# EAGLE design quantizer_control (EAGLE 6.6.0)
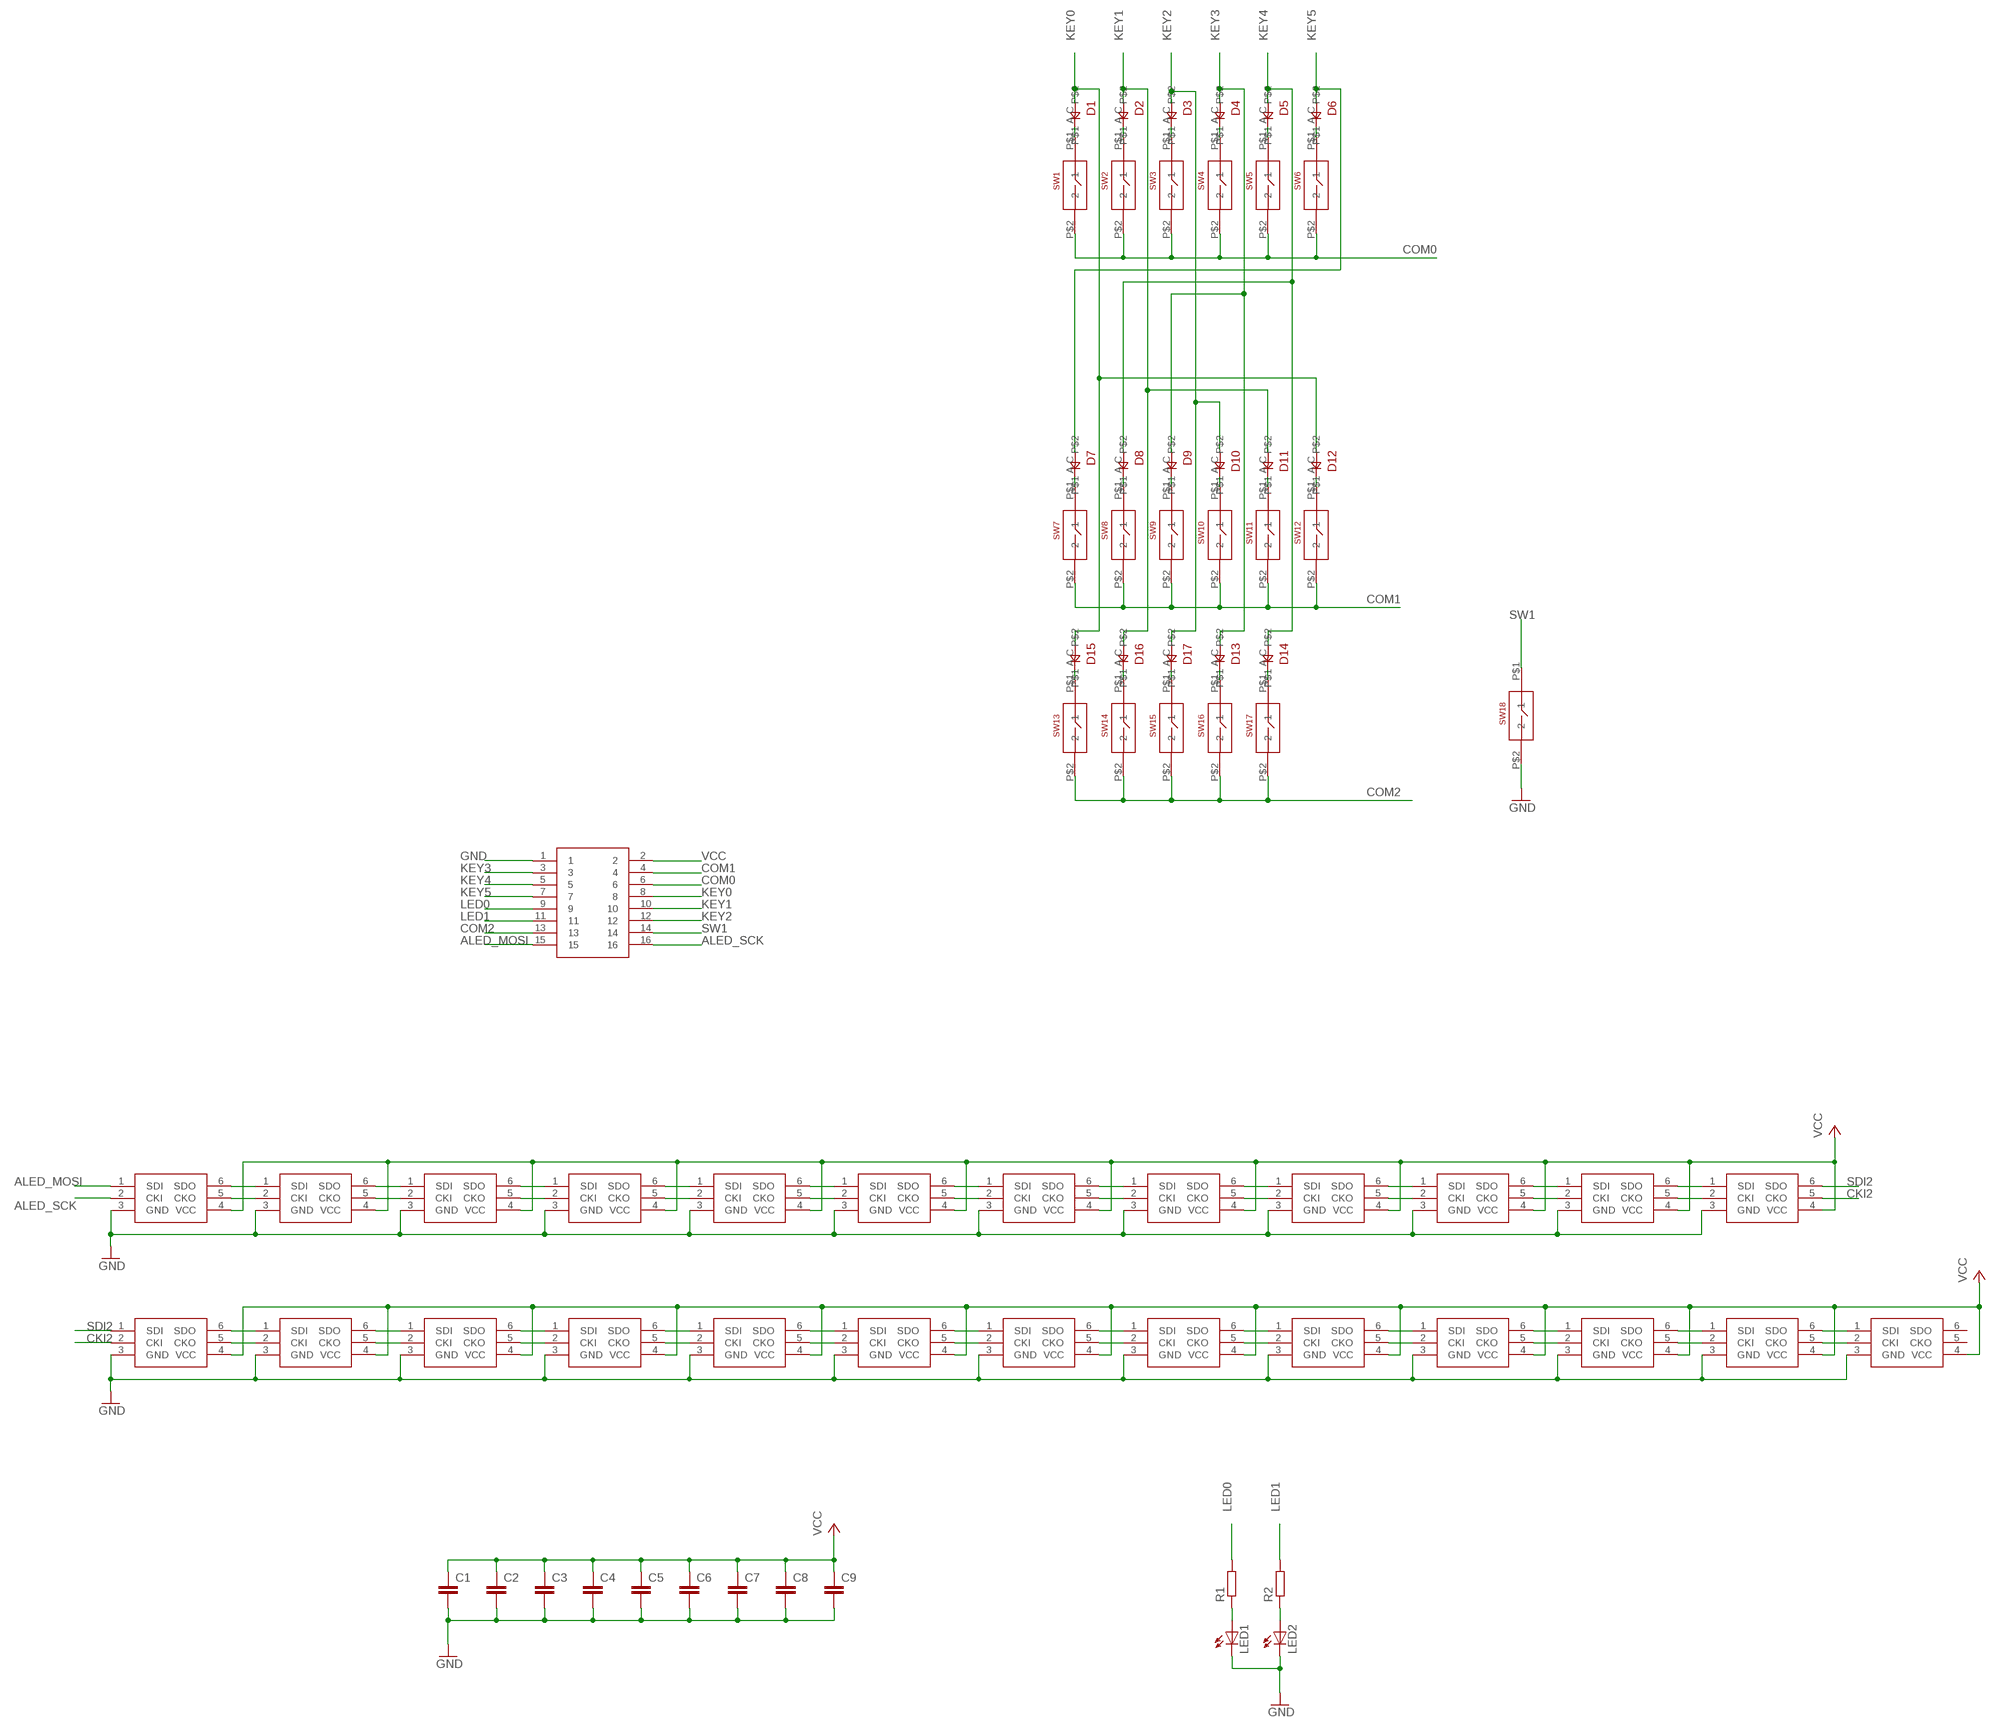
[diagram p0: schematic, sheet 1]

## Parts
C1  C-EUC0805  [C0805]
C2  C-EUC0805  [C0805]
C3  C-EUC0805  [C0805]
C4  C-EUC0805  [C0805]
C5  C-EUC0805  [C0805]
C6  C-EUC0805  [C0805]
C7  C-EUC0805  [C0805]
C8  C-EUC0805  [C0805]
C9  C-EUC0805  [C0805]
D1  0805DIODE  [0805DIODE]
D2  0805DIODE  [0805DIODE]
D3  0805DIODE  [0805DIODE]
D4  0805DIODE  [0805DIODE]
D5  0805DIODE  [0805DIODE]
D6  0805DIODE  [0805DIODE]
D7  0805DIODE  [0805DIODE]
D8  0805DIODE  [0805DIODE]
D9  0805DIODE  [0805DIODE]
D10  0805DIODE  [0805DIODE]
D11  0805DIODE  [0805DIODE]
D12  0805DIODE  [0805DIODE]
D13  0805DIODE  [0805DIODE]
D14  0805DIODE  [0805DIODE]
D15  0805DIODE  [0805DIODE]
D16  0805DIODE  [0805DIODE]
D17  0805DIODE  [0805DIODE]
LED1  LEDCHIP-LED0805  [CHIP-LED0805]
LED2  LEDCHIP-LED0805  [CHIP-LED0805]
R1  R-EU_R0805  [R0805]
R2  R-EU_R0805  [R0805]
SW1  SKPMSWITCH  [SKPMSWITCH]
SW2  SKPMSWITCH  [SKPMSWITCH]
SW3  SKPMSWITCH  [SKPMSWITCH]
SW4  SKPMSWITCH  [SKPMSWITCH]
SW5  SKPMSWITCH  [SKPMSWITCH]
SW6  SKPMSWITCH  [SKPMSWITCH]
SW7  SKPMSWITCH  [SKPMSWITCH]
SW8  SKPMSWITCH  [SKPMSWITCH]
SW9  SKPMSWITCH  [SKPMSWITCH]
SW10  SKPMSWITCH  [SKPMSWITCH]
SW11  SKPMSWITCH  [SKPMSWITCH]
SW12  SKPMSWITCH  [SKPMSWITCH]
SW13  SKPMSWITCH  [SKPMSWITCH]
SW14  SKPMSWITCH  [SKPMSWITCH]
SW15  SKPMSWITCH  [SKPMSWITCH]
SW16  SKPMSWITCH  [SKPMSWITCH]
SW17  SKPMSWITCH  [SKPMSWITCH]
SW18  SKPMSWITCH  [SKPMSWITCH]
U$1  2X8SMT  [2X8-SMT]
U$2  APA102-2020  [APA102-2020]
U$3  APA102-2020  [APA102-2020]
U$4  APA102-2020  [APA102-2020]
U$5  APA102-2020  [APA102-2020]
U$6  APA102-2020  [APA102-2020]
U$7  APA102-2020  [APA102-2020]
U$8  APA102-2020  [APA102-2020]
U$9  APA102-2020  [APA102-2020]
U$10  APA102-2020  [APA102-2020]
U$11  APA102-2020  [APA102-2020]
U$13  APA102-2020  [APA102-2020]
U$14  APA102-2020  [APA102-2020]
U$15  APA102-2020  [APA102-2020]
U$16  APA102-2020  [APA102-2020]
U$17  APA102-2020  [APA102-2020]
U$18  APA102-2020  [APA102-2020]
U$19  APA102-2020  [APA102-2020]
U$20  APA102-2020  [APA102-2020]
U$21  APA102-2020  [APA102-2020]
U$22  APA102-2020  [APA102-2020]
U$23  APA102-2020  [APA102-2020]
U$24  APA102-2020  [APA102-2020]
U$25  APA102-2020  [APA102-2020]
U$26  APA102-2020  [APA102-2020]
U$27  APA102-2020  [APA102-2020]

## Nets
ALED_MOSI: U$1.15 U$2.1(SDI)
ALED_SCK: U$1.16 U$2.2(CKI)
CKI2: U$14.5(CKO) U$15.2(CKI)
COM0: SW1.P$2 SW2.P$2 SW3.P$2 SW4.P$2 SW5.P$2 SW6.P$2 U$1.6
COM1: SW7.P$2 SW8.P$2 SW9.P$2 SW10.P$2 SW11.P$2 SW12.P$2 U$1.4
COM2: SW13.P$2 SW14.P$2 SW15.P$2 SW16.P$2 SW17.P$2 U$1.13
GND: C1.2 C2.2 C3.2 C4.2 C5.2 C6.2 C7.2 C8.2 C9.2 LED1.C LED2.C SW18.P$2 U$1.1 U$2.3(GND) U$3.3(GND) U$4.3(GND) U$5.3(GND) U$6.3(GND) U$7.3(GND) U$8.3(GND) U$9.3(GND) U$10.3(GND) U$11.3(GND) U$13.3(GND) U$14.3(GND) U$15.3(GND) U$16.3(GND) U$17.3(GND) U$18.3(GND) U$19.3(GND) U$20.3(GND) U$21.3(GND) U$22.3(GND) U$23.3(GND) U$24.3(GND) U$25.3(GND) U$26.3(GND) U$27.3(GND)
KEY0: D1.C D12.C D15.C U$1.8
KEY1: D2.C D11.C D16.C U$1.10
KEY2: D3.C D10.C D17.C U$1.12
KEY3: D4.C D9.C D13.C U$1.3
KEY4: D5.C D8.C D14.C U$1.5
KEY5: D6.C D7.C U$1.7
LED0: R1.2 U$1.9
LED1: R2.2 U$1.11
N$1: U$26.6(SDO) U$27.1(SDI)
N$2: U$26.5(CKO) U$27.2(CKI)
N$3: D1.A SW1.P$1
N$4: D2.A SW2.P$1
N$5: D3.A SW3.P$1
N$6: D4.A SW4.P$1
N$7: D5.A SW5.P$1
N$8: U$2.6(SDO) U$3.1(SDI)
N$9: U$2.5(CKO) U$3.2(CKI)
N$10: D6.A SW6.P$1
N$11: U$3.6(SDO) U$4.1(SDI)
N$12: U$3.5(CKO) U$4.2(CKI)
N$13: U$4.6(SDO) U$5.1(SDI)
N$14: U$4.5(CKO) U$5.2(CKI)
N$15: U$5.6(SDO) U$6.1(SDI)
N$16: U$5.5(CKO) U$6.2(CKI)
N$17: U$6.6(SDO) U$7.1(SDI)
N$18: U$6.5(CKO) U$7.2(CKI)
N$19: U$7.6(SDO) U$8.1(SDI)
N$20: U$7.5(CKO) U$8.2(CKI)
N$21: U$8.6(SDO) U$9.1(SDI)
N$22: U$8.5(CKO) U$9.2(CKI)
N$23: U$9.6(SDO) U$10.1(SDI)
N$24: U$9.5(CKO) U$10.2(CKI)
N$25: U$10.6(SDO) U$11.1(SDI)
N$26: U$10.5(CKO) U$11.2(CKI)
N$27: U$11.6(SDO) U$13.1(SDI)
N$28: U$11.5(CKO) U$13.2(CKI)
N$29: U$13.6(SDO) U$14.1(SDI)
N$30: D7.A SW7.P$1
N$31: U$13.5(CKO) U$14.2(CKI)
N$32: LED1.A R1.1
N$33: U$15.6(SDO) U$16.1(SDI)
N$34: U$15.5(CKO) U$16.2(CKI)
N$35: U$16.6(SDO) U$17.1(SDI)
N$36: D8.A SW8.P$1
N$37: U$16.5(CKO) U$17.2(CKI)
N$38: U$17.6(SDO) U$18.1(SDI)
N$39: U$17.5(CKO) U$18.2(CKI)
N$40: U$18.6(SDO) U$19.1(SDI)
N$41: U$18.5(CKO) U$19.2(CKI)
N$42: U$19.6(SDO) U$20.1(SDI)
N$43: U$19.5(CKO) U$20.2(CKI)
N$44: U$20.6(SDO) U$21.1(SDI)
N$45: D9.A SW9.P$1
N$46: U$20.5(CKO) U$21.2(CKI)
N$47: U$21.6(SDO) U$22.1(SDI)
N$48: U$21.5(CKO) U$22.2(CKI)
N$49: D10.A SW10.P$1
N$50: U$22.6(SDO) U$23.1(SDI)
N$51: U$22.5(CKO) U$23.2(CKI)
N$52: U$23.6(SDO) U$24.1(SDI)
N$53: U$23.5(CKO) U$24.2(CKI)
N$54: U$24.6(SDO) U$25.1(SDI)
N$55: U$24.5(CKO) U$25.2(CKI)
N$56: U$25.6(SDO) U$26.1(SDI)
N$57: U$25.5(CKO) U$26.2(CKI)
N$58: LED2.A R2.1
N$59: D11.A SW11.P$1
N$60: D12.A SW12.P$1
N$61: D15.A SW13.P$1
N$62: D16.A SW14.P$1
N$63: D17.A SW15.P$1
N$64: D13.A SW16.P$1
N$65: D14.A SW17.P$1
SDI2: U$14.6(SDO) U$15.1(SDI)
SW1: SW18.P$1 U$1.14
VCC: C1.1 C2.1 C3.1 C4.1 C5.1 C6.1 C7.1 C8.1 C9.1 U$1.2 U$2.4(VCC) U$3.4(VCC) U$4.4(VCC) U$5.4(VCC) U$6.4(VCC) U$7.4(VCC) U$8.4(VCC) U$9.4(VCC) U$10.4(VCC) U$11.4(VCC) U$13.4(VCC) U$14.4(VCC) U$15.4(VCC) U$16.4(VCC) U$17.4(VCC) U$18.4(VCC) U$19.4(VCC) U$20.4(VCC) U$21.4(VCC) U$22.4(VCC) U$23.4(VCC) U$24.4(VCC) U$25.4(VCC) U$26.4(VCC) U$27.4(VCC)
Unconnected: U$27.5(CKO) U$27.6(SDO)

## Library data of the parts
C1-C9 = rcl:C-EU: CAPACITOR, European symbol
D1-D17 = jasons_stuff:0805DIODE
LED1 LED2 = led:LED: LED OSRAM: - CHIPLED LG R971, LG N971, LY N971, LG Q971, LY Q971, LO R971, LY R971 LH N974, LH R974 LS Q976, LO Q976, LY Q976 LO Q996 - Hyper CHIPLED LW Q18S LB Q993, LB Q99A, LB R99A - SideLED LS A670, LO A670, LY A670, LG A670, LP A670 LB A673, LV A673, LT A673, LW A673 LH A674 LY A675 LS A676, LA A676, LO A676, LY A676, LW A676 LS A679, LY A679, LG A679 - Hyper Micro SIDELED® LS Y876, LA Y876, LO Y876, LY Y876 LT Y87S - SmartLED LW L88C, LW L88S LB L89C, LB L89S, LG L890 LS L89K, LO L89K, LY L89K LS L896, LA L896, LO L896, LY L896 - TOPLED LS T670, LO T670, LY T670, LG T670, LP T670 LSG T670, LSP T670, LSY T670, LOP T670, LYG T670 LG T671, LOG T671, LSG T671 LB T673, LV T673, LT T673, LW T673 LH T674 LS T676, LA T676, LO T676, LY T676, LB T676, LH T676, LSB T676, LW T676 LB T67C, LV T67C, LT T67C, LS T67K, LO T67K, LY T67K, LW E67C LS E67B, LA E67B, LO E67B, LY E67B, LB E67C, LV E67C, LT E67C LW T67C LS T679, LY T679, LG T679 LS T770, LO T770, LY T770, LG T770, LP T770 LB T773, LV T773, LT T773, LW T773 LH T774 LS E675, LA E675, LY E675, LS T675 LS T776, LA T776, LO T776, LY T776, LB T776 LHGB T686 LT T68C, LB T68C - Hyper Mini TOPLED® LB M676 - Mini TOPLED Santana® LG M470 LS M47K, LO M47K, LY M47K Source: http://www.osram.convergy.de LUXEON: - LUMILED® LXK2-PW12-R00, LXK2-PW12-S00, LXK2-PW14-U00, LXK2-PW14-V00 LXK2-PM12-R00, LXK2-PM12-S00, LXK2-PM14-U00 LXK2-PE12-Q00, LXK2-PE12-R00, LXK2-PE12-S00, LXK2-PE14-T00, LXK2-PE14-U00 LXK2-PB12-K00, LXK2-PB12-L00, LXK2-PB12-M00, LXK2-PB14-N00, LXK2-PB14-P00, LXK2-PB14-Q00 LXK2-PR12-L00, LXK2-PR12-M00, LXK2-PR14-Q00, LXK2-PR14-R00 LXK2-PD12-Q00, LXK2-PD12-R00, LXK2-PD12-S00 LXK2-PH12-R00, LXK2-PH12-S00 LXK2-PL12-P00, LXK2-PL12-Q00, LXK2-PL12-R00 Source: www.luxeon.com KINGBRIGHT: KA-3528ASYC Source: www.kingbright.com
R1 R2 = rcl:R-EU_: RESISTOR, European symbol
SW1-SW18 = jason_eagle6:SKPMSWITCH
U$1 = jason_eagle6:2X8SMT
U$2-U$11 U$13-U$27 = jason_eagle6:APA102-2020

## Board
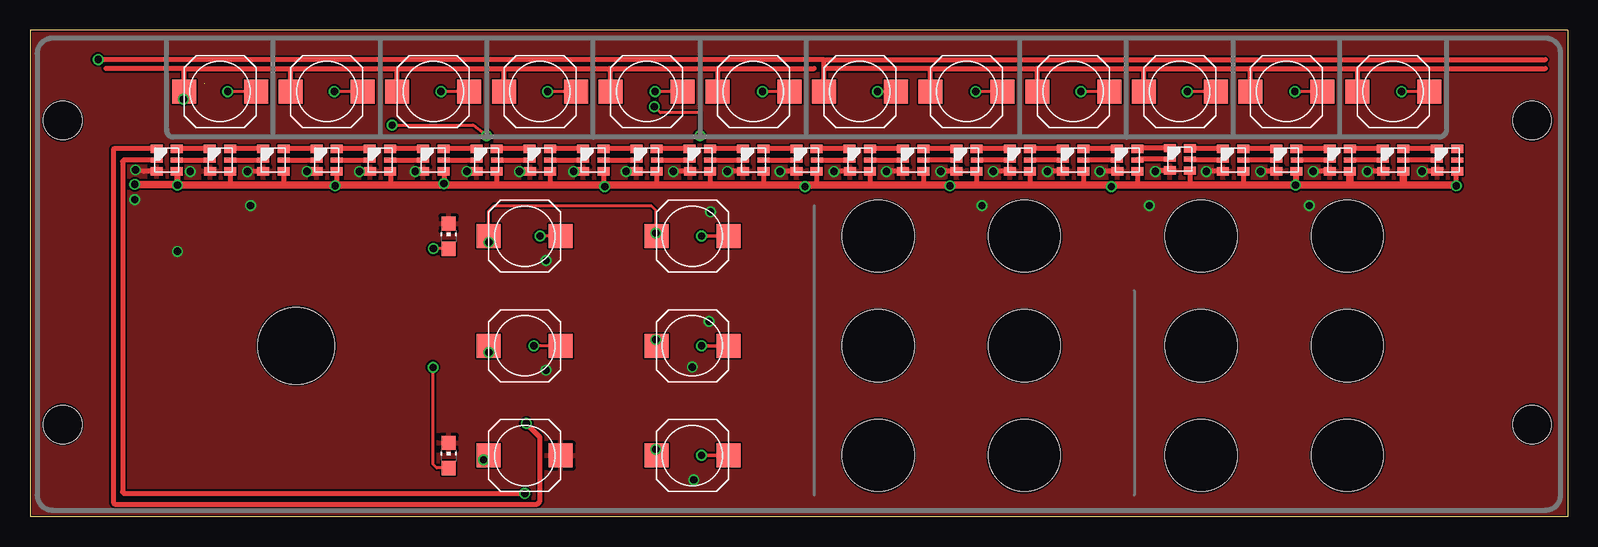
[diagram p1: board, top side]
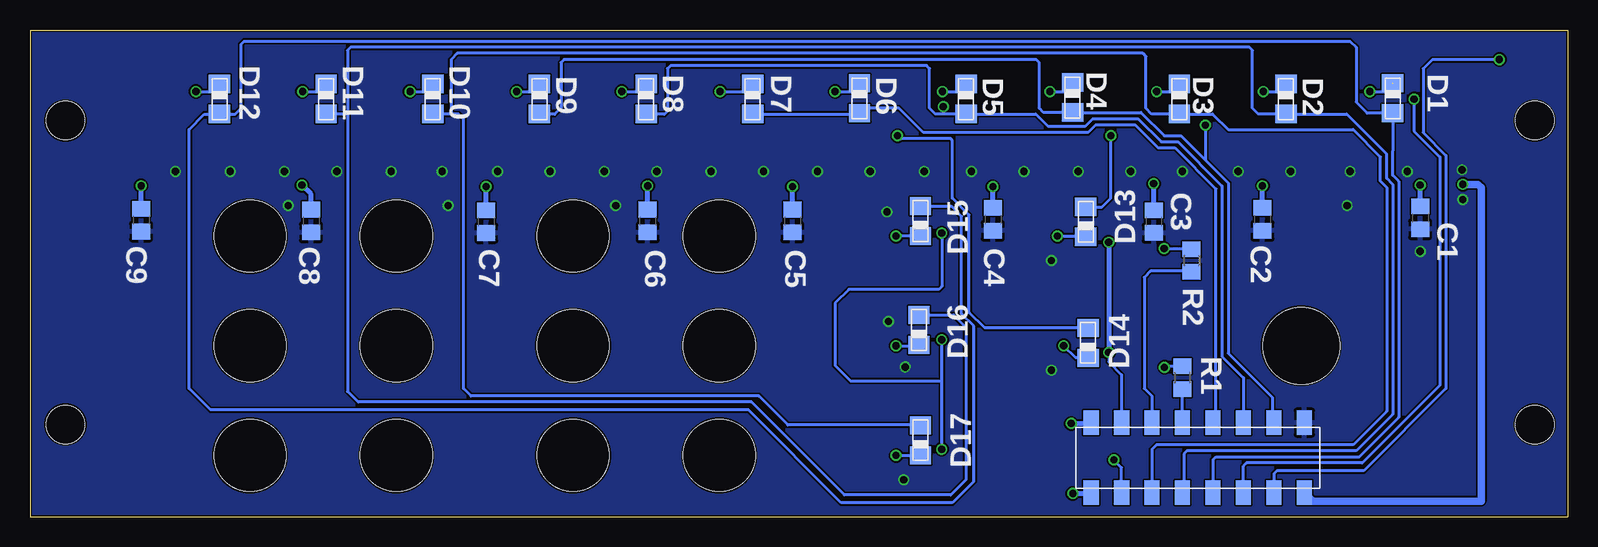
[diagram p2: board, bottom side, seen from below]

Size 128.17 x 40.59 mm. Coordinates in mm from the lower left corner, seen from the top.
Outline: 128.17,40.58 0,40.58 0,0 128.17,0 128.17,40.58
Copper layers (1*16): Top 0.035mm / dielectric 1.5mm / Bottom 0.035mm
Design rules "hackvana": minimum track width 6mil, minimum drill 0.3mm, track to track 6mil, track to pad 9mil, pad to pad 6mil, via to via 6mil, smd to smd 0mil, copper to edge 6mil, drill to drill 6mil, minimum pad ring 10mil, minimum via ring 6mil, stop-mask expansion 2mil, vias tented up to drill 100mil, thermal gap 10mil
Holes 6 mm at 70.71,23.39 82.9,23.39 70.71,14.24 82.9,14.24 70.71,5.1 82.9,5.1 97.63,5.1 109.82,5.1 109.82,14.24 97.63,14.24 109.82,23.39 97.63,23.39
Holes 6.4 mm at 22.19,14.24
Holes 3.2 mm at 125.21,33.03 125.21,7.68 2.73,7.68 2.73,33.03

### Footprints (pad centres in the part's own frame; a part is rotated, then mirrored left to right if it is on the bottom)
C0805 = smd 1.3 x 1.5: 1 -0.95,0; 2 0.95,0
0805DIODE = smd 1.524 x 1.778: A -1.262,-0.005; C 1.238,-0.005
CHIP-LED0805 = smd 1.2 x 1.2: A 0,-1.05; C 0,1.05
R0805 = smd 1.3 x 1.5: 1 -0.95,0; 2 0.95,0
SKPMSWITCH = smd 2 x 2: P$1 -3,0; P$2 3,0
2X8-SMT = smd 1.27 x 2.032: 1 -16.51,-2.921; 2 -16.51,2.921; 3 -13.97,-2.921; 4 -13.97,2.921; 5 -11.43,-2.921; 6 -11.43,2.921; 7 -8.89,-2.921; 8 -8.89,2.921; 9 -6.35,-2.921; 10 -6.35,2.921; 11 -3.81,-2.921; 12 -3.81,2.921; 13 -1.27,-2.921; 14 -1.27,2.921; 15 1.27,-2.921; 16 1.27,2.921
APA102-2020 = smd 1 x 0.7: 1 -0.85,0.93; 3 -0.84,-0.93; 4 0.84,-0.95; 6 0.84,0.92 | smd 1 x 0.42: 2 -0.85,0; 5 0.85,0

### Placement (x,y rotation side)
C1  12.29,24.91 270 bottom
C2  25.43,24.79 270 bottom
C3  34.5,24.61 270 bottom
C4  47.91,24.79 270 bottom
C5  64.61,24.66 270 bottom
C6  76.68,24.66 270 bottom
C7  90.14,24.6 270 bottom
C8  104.74,24.66 270 bottom
C9  118.9,24.72 270 bottom
D1  14.57,34.88 270 bottom
D2  23.46,34.82 270 bottom
D3  32.35,34.82 270 bottom
D4  41.24,34.95 270 bottom
D5  50.13,34.82 270 bottom
D6  59.02,34.88 270 bottom
D7  67.91,34.82 270 bottom
D8  76.8,34.82 270 bottom
D9  85.69,34.82 270 bottom
D10  94.58,34.82 270 bottom
D11  103.47,34.82 270 bottom
D12  112.36,34.82 270 bottom
D13  40.16,24.6 90 bottom
D14  39.97,14.5 90 bottom
D15  53.94,24.66 90 bottom
D16  54.07,15.58 90 bottom
D17  53.94,6.37 90 bottom
LED1  34.89,5.1 0 top
LED2  34.89,23.39 0 top
R1  32.1,11.58 270 bottom
R2  31.34,21.36 270 bottom
SW1  15.84,35.45 180 top
SW2  24.73,35.45 180 top
SW3  33.62,35.45 180 top
SW4  42.51,35.45 180 top
SW5  51.4,35.45 180 top
SW6  60.29,35.45 180 top
SW7  69.18,35.45 180 top
SW8  78.07,35.45 180 top
SW9  86.96,35.45 180 top
SW10  95.85,35.45 180 top
SW11  104.74,35.45 180 top
SW12  113.63,35.45 180 top
SW13  55.21,23.39 180 top
SW14  55.21,14.24 180 top
SW15  55.21,5.1 180 top
SW16  41.24,23.39 180 top
SW17  41.24,14.24 180 top
SW18  41.24,5.1 0 top
U$1  38.45,4.91 180 bottom
U$2  11.4,29.74 0 top
U$3  15.84,29.74 0 top
U$4  20.29,29.74 0 top
U$5  24.73,29.74 0 top
U$6  29.18,29.74 0 top
U$7  33.62,29.74 0 top
U$8  38.07,29.74 0 top
U$9  42.51,29.74 0 top
U$10  46.96,29.74 0 top
U$11  51.4,29.74 0 top
U$13  55.85,29.74 0 top
U$14  60.29,29.74 0 top
U$15  64.74,29.74 0 top
U$16  69.18,29.74 0 top
U$17  73.63,29.74 0 top
U$18  78.07,29.74 0 top
U$19  82.52,29.74 0 top
U$20  86.96,29.74 0 top
U$21  91.47,29.74 0 top
U$22  95.85,29.8 0 top
U$23  100.3,29.74 0 top
U$24  104.74,29.74 0 top
U$25  109.19,29.74 0 top
U$26  113.63,29.74 0 top
U$27  118.14,29.74 0 top

### Tracks (layer width: path | path; a pad name or v marks a point on that pad's centre or on a via)
ALED_MOSI  (via drill 0.6)
  Top 0.406: U$2.1 6.99,30.67 6.95,30.63 6.95,1.16 7.08,1.04 42.26,1.04 42.51,1.29 42.51,6.62 v41.37,7.77
  Bottom 0.406: v41.37,7.77 39.78,7.77 U$1.15
ALED_SCK  (via drill 0.6)
  Top 0.406: U$2.2 7.84,29.74 7.71,29.61 7.71,2.05 7.84,1.93 v41.24,1.93
  Bottom 0.406: v41.24,1.93 39.78,1.93 U$1.16
CKI2
  Top 0.406: U$14.5 U$15.2
COM0  (via drill 0.6)
  Top 0.254: 12.84,35.79 12.79,35.83 | v12.79,34.82 12.84,34.87 SW1.P$2 12.79,35.5 12.79,35.83 | 12.79,35.83 12.79,36.04 12.84,36.09
  Top 0.406: 12.84,36.09 12.84,37.34 12.86,37.36 | 12.86,37.36 21.87,37.36 | 21.87,37.36 30.64,37.36 | 30.64,37.36 39.65,37.36 | 39.65,37.36 48.29,37.36 | 48.29,37.36 57.31,37.36 | 57.31,37.36 57.31,35.47 SW6.P$2 | SW5.P$2 48.4,37.25 48.29,37.36 | SW4.P$2 39.51,37.22 39.65,37.36 | SW3.P$2 30.62,37.34 30.64,37.36 | SW2.P$2 21.73,37.22 21.87,37.36 | 57.31,37.36 65.37,37.36 | 12.86,37.36 6.32,37.36
  Bottom 0.254: U$1.6 27.02,4.21 26.76,4.47 17.11,4.47 10.64,10.94 10.64,29.99 12.79,32.15 v12.79,34.82
COM1  (via drill 0.6)
  Top 0.254: 66.13,35.83 66.18,35.79 SW7.P$2 66.82,34.82 | 66.18,38.07 66.18,37.56 66.39,37.36
  Top 0.406: 75.15,37.36 83.91,37.36 | 83.91,37.36 92.93,37.36 | 92.93,37.36 101.69,37.36 | 101.69,37.36 110.65,37.36 | 110.65,37.36 110.65,35.47 SW12.P$2 | SW11.P$2 101.74,37.31 101.69,37.36 | SW10.P$2 92.85,37.28 92.93,37.36 | SW9.P$2 83.96,37.31 83.91,37.36 | SW8.P$2 75.07,37.28 75.15,37.36 | 75.15,37.36 66.39,37.36 | 110.65,37.36 126.33,37.36 | SW7.P$2 66.18,38.07 66.13,38.12 | 66.13,38.12 v5.68,38.12 | 66.13,38.12 126.33,38.12
  Bottom 0.254: v5.68,38.12 11.27,38.12 12.03,37.36 12.03,32.02 10.13,30.12 10.13,10.69 16.99,3.83 24.22,3.83 24.48,3.58 U$1.4
COM2  (via drill 0.6, 0.6 pad 0.25)
  Top 0.254: SW13.P$2 52.21,23.59 v52.16,23.64 52.16,25.55 51.78,25.93 38.7,25.93 38.24,25.47 SW16.P$2 | v52.16,5.61 52.16,5.15 SW15.P$2 | v52.16,14.75 52.16,14.29 SW14.P$2
  Top 0.406: SW16.P$2 38.22,23.39 38.22,22.91 38.25,22.91 v38.25,22.88 | v38.25,13.69 v38.24,13.69 SW17.P$2
  Bottom 0.254: v52.16,5.61 52.16,11.32 | 52.16,11.32 v52.16,14.75 | v52.16,23.64 52.16,19.2 52.42,18.94 59.91,18.94 61.05,17.8 61.05,12.59 59.78,11.32 52.16,11.32 | v38.25,13.69 38.25,12.9 37.18,11.83 U$1.13
  Bottom 0.406: v38.25,22.88 v38.25,13.69
GND  (via drill 0.6)
  Top 0.406: U$27.3 116.2,28.81 v116.05,28.79 | U$26.3 111.62,28.81 v111.47,28.79 | U$25.3 106.99,28.81 v106.96,28.79 | U$24.3 102.8,28.81 v102.58,28.79 | U$23.3 98.1,28.81 v98.07,28.79 | U$22.3 93.91,28.87 v93.82,28.79 | U$21.3 89.46,28.81 v89.18,28.79 | U$20.3 85.02,28.81 v84.8,28.79 | U$19.3 80.64,28.81 v80.29,28.79 | U$18.3 76.06,28.81 v75.91,28.79 | U$17.3 71.24,28.81 v71.4,28.79 | U$16.3 67.17,28.81 v67.02,28.79 | U$15.3 62.73,28.81 v62.52,28.79 | U$14.3 58.28,28.81 v58.13,28.79 | U$13.3 53.96,28.81 v53.63,28.79 | U$11.3 49.65,28.81 v49.69,28.79 | U$10.3 45.58,28.81 v45.31,28.79 | U$9.3 40.76,28.81 | U$8.3 36.95,28.81 v36.42,28.79 | U$7.3 32.12,28.81 v32.1,28.79 | U$6.3 27.3,28.81 v27.46,28.79 | U$5.3 23.23,28.81 v23.08,28.79 | U$4.3 18.91,28.81 v18.13,28.79 | U$2.3 9.52,28.81 v8.79,28.91
  other vias: 40.8,28.79 13.37,28.79 56.74,25.42 56.61,16.28 43.02,21.36 43.02,12.21 55.34,3.07 55.21,12.47 8.73,26.44 12.29,22.12 18.38,25.93 79.34,25.93 93.31,25.93 106.65,25.93
  pour Bottom: 128.87,42.44 -4.48,42.44 -4.48,-2.01 128.87,-2.01
  pour Top: -1.94,42.44 -3.21,42.44 -3.21,-2.01 130.14,-2.01 130.14,42.44
KEY0
  Bottom 0.254: D15.C 51.37,25.9 50.51,25.04 50.51,16.91 49.5,15.9 49.5,2.94 51.28,1.16 60.55,1.16 68.29,8.91 113.12,8.91 114.9,10.69 114.9,32.28 113.63,33.55 112.4,33.55 D12.C 111.06,33.58 110.58,34.06 110.58,39.39 110.33,39.64 18.13,39.64 17.62,39.14 17.62,34.56 16.7,33.64 D1.C 14.58,30.51 14.57,30.5 14.57,28.47 14.06,27.96 14.06,8.28 17.37,4.97 29.3,4.97 29.56,4.72 U$1.8
KEY1
  Bottom 0.254: 101.69,33.55 103.45,33.55 D11.C | D16.C 51.18,16.82 50.13,15.77 50.13,3.07 51.4,1.8 60.29,1.8 68.04,9.55 100.81,9.55 101.69,10.43 101.69,33.55 | 101.69,33.55 101.69,38.88 101.44,39.14 26.51,39.14 26.26,38.88 26.26,34.06 25.78,33.58 D2.C 18.41,33.58 15.08,30.25 15.08,28.21 14.57,27.71 14.57,8.53 17.62,5.48 31.72,5.48 31.97,5.23 31.97,2.12 U$1.10
KEY2
  Bottom 0.254: 93.06,33.55 93.06,38.12 92.55,38.63 35.4,38.63 35.15,38.37 35.15,34.06 34.67,33.58 D3.C 29.59,33.58 28.29,32.28 17.87,32.28 15.59,29.99 15.59,27.96 15.08,27.45 15.08,8.78 17.87,5.99 34.26,5.99 34.64,5.61 U$1.12 | 93.06,33.55 92.42,33.55 92.04,33.17 92.04,10.69 91.41,10.05 67.4,10.05 64.99,7.64 53.94,7.64 53.94,8.15 53.94,8.14 D17.C | 93.06,33.55 94.56,33.55 D10.C
KEY3  (via drill 0.6)
  Top 0.254: v30.19,32.66 36.92,32.66 v38.07,31.77
  Bottom 0.254: D9.C 85.67,33.55 84.42,33.55 83.91,34.06 83.91,37.87 83.66,38.12 44.29,38.12 44.04,37.87 44.04,34.06 43.69,33.71 D4.C 35.56,33.71 33.62,31.77 32.23,31.77 30.19,29.74 | D13.C 38.8,25.83 38.07,26.56 v38.07,31.77 | U$1.3 24.61,7.96 24.61,9.93 28.29,13.61 28.29,27.83 30,29.55 30.19,29.74 | v30.19,32.66 30.19,29.74
KEY4  (via drill 0.6)
  Top 0.254: v55.85,31.77 55.85,33.68 52.55,33.68 v52.04,34.18
  Bottom 0.254: 52.04,33.58 D5.C 44.32,33.58 43.27,32.53 40.23,32.53 39.59,33.17 35.78,33.17 33.88,31.26 32.48,31.26 28.8,27.58 28.8,13.36 27.02,11.58 U$1.5 | 52.04,33.58 52.7,33.58 53.18,34.06 53.18,37.36 53.43,37.61 74.77,37.61 75.02,37.36 75.02,33.8 75.28,33.55 76.78,33.55 D8.C | D14.C 48.58,15.74 49.88,17.04 49.88,25.17 51.28,26.56 51.28,31.39 51.4,31.52 55.59,31.52 v55.85,31.77 | v52.04,34.18 52.04,33.58
KEY5
  Bottom 0.254: D7.C 59.09,33.58 D6.C 58.61,34.06 55.72,34.06 53.69,32.02 39.97,32.02 39.34,32.66 36.04,32.66 34.13,30.75 32.73,30.75 29.3,27.33 29.3,8.08 U$1.7
LED0
  Bottom 0.254: U$1.9 R1.2
LED1
  Bottom 0.254: R2.2 31.4,20.47 34.77,20.47 35.27,19.96 35.27,10.69 34.64,10.05 U$1.11
N$1
  Top 0.406: U$27.1 U$26.6
N$2
  Top 0.406: U$27.2 U$26.5
N$3  (via drill 0.6)  (1 unrouted)
  Top 0.254: SW1.P$1 v16.48,35.45
  Bottom 0.254: v16.48,35.45 15.21,35.45 14.57,36.09
N$4  (via drill 0.6)
  Top 0.254: SW2.P$1 v25.37,35.45
  Bottom 0.254: v25.37,35.45 24.09,35.45 D2.A
N$5  (via drill 0.6)
  Top 0.254: SW3.P$1 v34.26,35.45
  Bottom 0.254: v34.26,35.45 32.98,35.45 D3.A
N$6  (via drill 0.6)
  Top 0.254: SW4.P$1 v43.15,35.45
  Bottom 0.254: v43.15,35.45 42,35.45 D4.A
N$7  (via drill 0.6)
  Top 0.254: SW5.P$1 v52.1,35.45
  Bottom 0.254: v52.1,35.45 50.76,35.45 D5.A
N$8
  Top 0.406: U$3.1 12.25,30.67 U$2.6
N$9
  Top 0.406: U$2.5 U$3.2
N$10  (via drill 0.6)
  Top 0.254: SW6.P$1 v61.05,35.45
  Bottom 0.254: v61.05,35.45 59.72,35.45 D6.A
N$11
  Top 0.406: U$4.1 U$3.6
N$12
  Top 0.406: U$3.5 U$4.2
N$13
  Top 0.406: U$5.1 U$4.6
N$14
  Top 0.406: U$4.5 U$5.2
N$15
  Top 0.406: U$6.1 U$5.6
N$16
  Top 0.406: U$5.5 U$6.2
N$17
  Top 0.406: U$7.1 U$6.6
N$18
  Top 0.406: U$6.5 U$7.2
N$19
  Top 0.406: U$8.1 U$7.6
N$20
  Top 0.406: U$7.5 U$8.2
N$21
  Top 0.406: U$9.1 U$8.6
N$22
  Top 0.406: U$8.5 U$9.2
N$23
  Top 0.406: U$10.1 U$9.6
N$24
  Top 0.406: U$9.5 U$10.2
N$25
  Top 0.406: U$11.1 U$10.6
N$26
  Top 0.406: U$10.5 U$11.2
N$27
  Top 0.406: U$13.1 U$11.6
N$28
  Top 0.406: U$11.5 U$13.2
N$29
  Top 0.406: U$14.1 U$13.6
N$30  (via drill 0.6)
  Top 0.254: SW7.P$1 v70.64,35.45
  Bottom 0.254: v70.64,35.45 68.54,35.45 D7.A
N$31
  Top 0.406: U$13.5 U$14.2
N$32  (via drill 0.6)
  Top 0.254: LED1.A 33.91,4.05 33.62,4.34 33.62,12.42 v33.6,12.44
  Bottom 0.254: R1.1 33.51,12.53 v33.6,12.44
N$33
  Top 0.406: U$16.1 U$15.6
N$34
  Top 0.406: U$15.5 U$16.2
N$35
  Top 0.406: U$17.1 U$16.6
N$36  (via drill 0.6)
  Top 0.254: SW8.P$1 v78.83,35.45
  Bottom 0.254: v78.83,35.45 77.43,35.45 D8.A
N$37
  Top 0.406: U$16.5 U$17.2
N$38
  Top 0.406: U$18.1 74.48,30.67 U$17.6
N$39
  Top 0.406: U$18.2 U$17.5
N$40
  Top 0.406: U$19.1 U$18.6
N$41
  Top 0.406: U$19.2 U$18.5
N$42
  Top 0.406: U$20.1 83.37,30.67 U$19.6
N$43
  Top 0.406: U$20.2 U$19.5
N$44
  Top 0.406: U$21.1 87.86,30.67 U$20.6
N$45  (via drill 0.6)
  Top 0.254: SW9.P$1 v87.6,35.45
  Bottom 0.254: v87.6,35.45 86.32,35.45 D9.A
N$46
  Top 0.406: U$21.2 U$20.5
N$47
  Top 0.406: U$22.1 92.38,30.73 U$21.6
N$48
  Top 0.406: U$22.2 92.38,29.8 U$21.5
N$49  (via drill 0.6)
  Top 0.254: SW10.P$1 v96.49,35.45
  Bottom 0.254: D10.A 94.6,35.45 v96.49,35.45
N$50
  Top 0.406: U$23.1 96.75,30.67 U$22.6
N$51
  Top 0.406: U$23.2 96.77,29.74 U$22.5
N$52
  Top 0.406: U$24.1 101.15,30.67 U$23.6
N$53
  Top 0.406: U$24.2 U$23.5
N$54
  Top 0.406: U$25.1 U$24.6
N$55
  Top 0.406: U$25.2 U$24.5
N$56
  Top 0.406: U$26.1 110.04,30.67 U$25.6
N$57
  Top 0.406: U$26.2 U$25.5
N$58  (via drill 0.6)
  Top 0.254: LED2.A 33.3,22.34 v33.62,22.35
  Bottom 0.254: v33.62,22.35 31.38,22.35 R2.1
N$59  (via drill 0.6)
  Top 0.254: SW11.P$1 v105.44,35.45
  Bottom 0.254: v105.44,35.45 104.1,35.45 D11.A
N$60  (via drill 0.6)
  Top 0.254: 116.63,36.14 SW12.P$1 v114.33,35.45
  Bottom 0.254: 112.38,35.45 D12.A 112.99,35.45 v114.33,35.45
N$61  (via drill 0.6)
  Top 0.305: SW13.P$1 v55.97,23.39
  Bottom 0.254: D15.A v55.97,23.4 v55.97,23.39
N$62  (via drill 0.6)
  Top 0.305: SW14.P$1 v55.97,14.24
  Bottom 0.254: v55.97,14.24 54.14,14.24 D16.A
N$63  (via drill 0.6)
  Top 0.305: SW15.P$1 v55.97,5.1
  Bottom 0.254: v55.97,5.1 53.95,5.1 D17.A
N$64  (via drill 0.6 pad 0.25)
  Top 0.254: SW16.P$1 v42.51,23.39
  Bottom 0.254: v42.51,23.39 40.21,23.39 D13.A
N$65  (via drill 0.6 pad 0.25)
  Top 0.254: SW17.P$1 v42,14.24
  Bottom 0.254: D14.A 41,13.24 v42,14.24
SDI2
  Top 0.406: 61.19,30.67 U$14.6 U$15.1
SW1  (via drill 0.6)
  Top 0.254: v37.81,4.72 37.86,4.72 SW18.P$1
  Bottom 0.254: U$1.14 37.18,4.08 v37.81,4.72
VCC  (via drill 0.6)
  Top 0.254: 34.51,27.78 32.49,27.78 32.35,27.64 | v25.43,27.58 23.53,27.58 23.46,27.64
  Top 0.406: 118.97,28.66 119.09,28.79 U$27.4 118.9,28.71 118.9,27.64 v118.9,27.58 | U$26.4 114.47,27.97 114.46,27.96 | U$25.4 110.03,28.1 | 105.58,28.17 U$24.4 105.5,28.71 v105.5,27.64 | U$23.4 101.14,27.85 100.93,27.64 | 12.35,27.96 12.35,28.68 U$2.4 12.29,28.74 v12.29,27.64 | 16.7,28.78 U$3.4 16.68,27.82 16.86,27.64 | U$6.4 30.07,28.74 30.07,27.77 30.19,27.64 | U$7.4 34.51,28.74 34.51,27.78 v34.5,27.77 | v47.91,27.52 47.91,27.77 | U$21.4 92.31,27.88 92.55,27.64 | U$20.4 87.8,27.85 87.6,27.64 | v90.14,27.52 90.26,27.64 | U$22.4 96.69,27.69 96.74,27.64 | U$19.4 83.36,27.85 83.15,27.64 | U$18.4 78.91,27.85 78.71,27.64 78.77,27.64 78.83,27.58 | U$17.4 74.47,27.85 74.26,27.64 | U$16.4 70.02,27.69 70.07,27.64 | v76.68,27.58 78.26,27.58 78.33,27.64 | U$14.4 61.13,27.85 60.93,27.64 | U$15.4 65.58,27.85 65.37,27.64 64.74,27.64 v64.61,27.52 | U$13.4 56.69,27.85 56.48,27.64 | U$10.4 47.8,27.63 v47.91,27.52 | U$11.4 52.24,27.72 52.16,27.64 | v47.91,27.52 48.1,27.52 48.23,27.64 | U$9.4 43.35,27.85 43.15,27.64 | U$8.4 38.91,27.95 39.21,27.64 | U$5.4 25.57,27.72 v25.43,27.58 | U$4.4 21.13,27.85 20.92,27.64
  Top 0.61: 109.82,27.64 v105.5,27.64 100.93,27.64 96.74,27.64 92.55,27.64 90.26,27.64 87.6,27.64 83.15,27.64 78.71,27.64 78.33,27.64 74.26,27.64 70.07,27.64 65.37,27.64 60.93,27.64 56.48,27.64 52.16,27.64 48.23,27.64 43.15,27.64 39.21,27.64 32.35,27.64 30.19,27.64 23.46,27.64 20.92,27.64 16.86,27.64 v12.29,27.64 12.22,27.71 v8.73,27.71 | 109.82,27.64 114.52,27.64 | 114.52,27.64 118.9,27.64 | U$25.4 110.03,27.85 109.82,27.64 | U$26.4 114.47,27.69 114.52,27.64
  Bottom 0.406: C7.1 v90.14,27.52 | C9.1 v118.9,27.58 | C6.1 v76.68,27.58 | C5.1 v64.61,27.52 | C4.1 v47.91,27.52 | C3.1 v34.5,27.77 | C2.1 v25.43,27.58 | C1.1 v12.29,27.64 | C8.1 104.74,26.88 v105.5,27.64
  Bottom 0.61: U$1.2 21.24,1.29 7.21,1.29 7.21,27.45 7.46,27.71 v8.73,27.71

### Text on the board
tDocu: TRG | SCAL | AMT | MIDI | SCAL | SAVE | ROOT | CHRD | ROOT | CHRD | OUT2 | OUT4 | IN | GRID | SHFT | GRID | OUT1 | OUT3
bDocu: cv quantizer control v1 | hotchk155